# EAGLE design LM-317_power_supply (EAGLE 7.7.0)
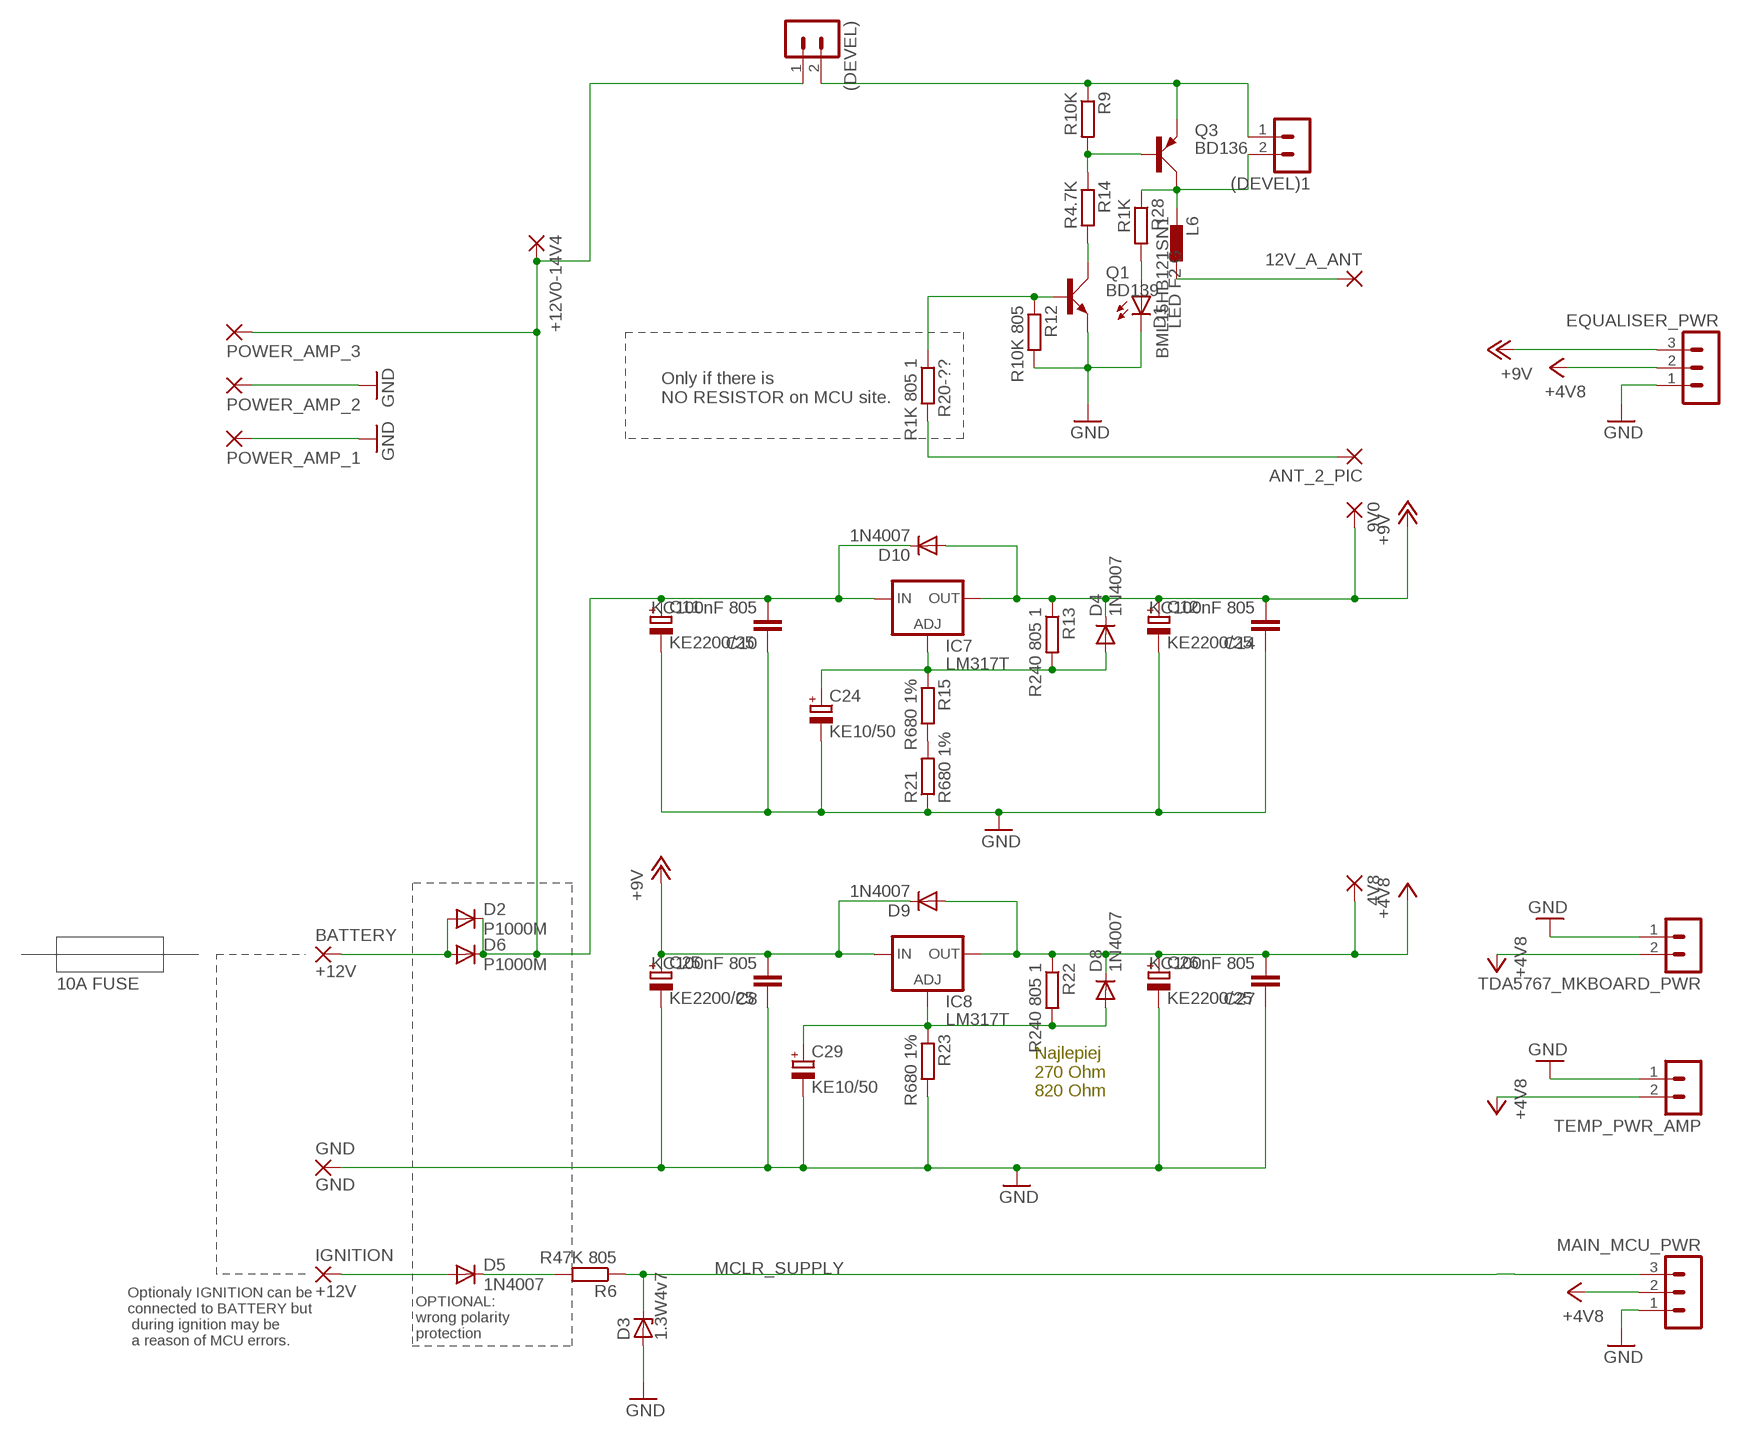
[diagram p0: schematic, sheet 1]

## Parts
4V8  3,17/1,3  [3,17/1,3]
9V0  3,17/1,3  [3,17/1,3]
12V_A_ANT  3,17/1,3  [3,17/1,3]
(DEVEL)  MA02-1  [MA02-1]
(DEVEL)1  MA02-1  [MA02-1]
+12V0-14V4  3,17/1,3  [3,17/1,3]
ANT_2_PIC  1,6/0,8  [1,6/0,8]
BATTERY  +12V  3,81/1,3  [3,81/1,3]
C8  KC100nF 805  C-EUC0805  [C0805]
C10  KC100nF 805  C-EUC0805  [C0805]
C11  KE2200/25  CPOL-EUE3.5-8  [E3,5-8]
C12  KE2200/25  CPOL-EUE3.5-8  [E3,5-8]
C14  KC100nF 805  C-EUC0805  [C0805]
C24  KE10/50  CPOL-EUTT2D4  [TT2D4]
C25  KE2200/25  CPOL-EUE3.5-8  [E3,5-8]
C26  KE2200/25  CPOL-EUE3.5-8  [E3,5-8]
C27  KC100nF 805  C-EUC0805  [C0805]
C29  KE10/50  CPOL-EUTT2D4  [TT2D4]
D1  LED F2 G  SFH482  [SFH482]
D2  P1000M  1N4004  [DO41-10]
D3  1.3W4v7  ZENER-DIODEZD-2.5  [ZDIO-2.5]
D4  1N4007  DIODE-D-5  [D-5]
D5  1N4007  DIODE-D-5  [D-5]
D6  P1000M  1N4004  [DO41-10]
D8  1N4007  DIODE-D-5  [D-5]
D9  1N4007  1N4004  [DO41-10]
D10  1N4007  1N4004  [DO41-10]
EQUALISER_PWR  MA03-1  [MA03-1]
GND  GND  3,81/1,3  [3,81/1,3]
IC7  LM317T  LM317TS  [317TS]
IC8  LM317T  LM317TS  [317TS]
IGNITION  +12V  3,81/1,3  [3,81/1,3]
L6  BML15HB121SN1  [0402]
MAIN_MCU_PWR  MA03-1  [MA03-1]
POWER_AMP_1  3,17/1,3  [3,17/1,3]
POWER_AMP_2  3,17/1,3  [3,17/1,3]
POWER_AMP_3  3,17/1,3  [3,17/1,3]
Q1  BD139  [TO126AV]
Q3  BD136  BD140  [TO126AV]
R6  R47K 805  R-EU_0204/2V  [0204V]
R9  R10K  R-EU_0204/5  [0204/5]
R12  R10K 805  R-EU_R0805  [R0805]
R13  R240 805 1  R-EU_M0805  [M0805]
R14  R4.7K  R-EU_0204/5  [0204/5]
R15  R680 1%  R-EU_0204/5  [0204/5]
R20-??  R1K 805 1  R-EU_0204/2V  [0204V]
R21  R680 1%  R-EU_0204/5  [0204/5]
R22  R240 805 1  R-EU_M0805  [M0805]
R23  R680 1%  R-EU_0204/5  [0204/5]
R28  R1K  R-EU_0204/7  [0204/7]
TDA5767_MKBOARD_PWR  MA02-1  [MA02-1]
TEMP_PWR_AMP  MA02-1  [MA02-1]

## Nets
+5V: 4V8.1(P) C26.+ C27.2 D8.C D9.A EQUALISER_PWR.2 IC8.2(OUT) MAIN_MCU_PWR.2 R22.1 TDA5767_MKBOARD_PWR.2 TEMP_PWR_AMP.2 ; supply symbol labelled +4V8
+12V: 9V0.1(P) C8.2 C12.+ C14.2 C25.+ D4.C D9.C D10.A EQUALISER_PWR.3 IC7.2(OUT) IC8.3(IN) R13.1 ; supply symbol labelled +9V
GND: C8.1 C10.1 C11.- C12.- C14.1 C24.- C25.- C26.- C27.1 C29.- D1.K(C) D3.A EQUALISER_PWR.1 GND.1(P) MAIN_MCU_PWR.1 POWER_AMP_1.1(P) POWER_AMP_2.1(P) Q1.E R12.2 R21.1 R23.2 TDA5767_MKBOARD_PWR.1 TEMP_PWR_AMP.1
MCLR_SUPPLY: D3.C MAIN_MCU_PWR.3 R6.1
N$1: ANT_2_PIC.1(P) R20-??.2
N$2: C24.+ D4.A IC7.1(ADJ) R13.2 R15.1
N$3: R15.2 R21.2
N$4: (DEVEL)1.1 (DEVEL).2 Q3.E R9.1
N$5: (DEVEL).1 +12V0-14V4.1(P) C10.2 C11.+ D2.C D6.C D10.C IC7.3(IN) POWER_AMP_3.1(P)
N$6: BATTERY.1(P) D2.A D6.A
N$13: D5.A IGNITION.1(P)
N$14: D5.C R6.2
N$18: Q1.B R12.1 R20-??.1
N$19: Q1.C R14.2
N$25: Q3.B R9.2 R14.1
N$26: (DEVEL)1.2 L6.1 Q3.C R28.1
N$27: C29.+ D8.A IC8.1(ADJ) R22.2 R23.1
N$33: 12V_A_ANT.1(P) L6.2
N$40: D1.A R28.2

## Notes on the sheet
- Only if there is
  NO RESISTOR on MCU site.
- 10A FUSE
- Najlepiej
  270 Ohm
  820 Ohm
- OPTIONAL:
  wrong polarity
  protection
- Optionaly IGNITION can be
  connected to BATTERY but
   during ignition may be
   a reason of MCU errors.

## Library data of the parts
4V8 9V0 12V_A_ANT +12V0-14V4 POWER_AMP_1-POWER_AMP_3 = wirepad:3,17/1,3: THROUGH-HOLE PAD
(DEVEL) (DEVEL)1 TDA5767_MKBOARD_PWR TEMP_PWR_AMP = con-lstb_SileliS:MA02-1: PIN HEADER
ANT_2_PIC = wirepad:1,6/0,8: THROUGH-HOLE PAD
BATTERY GND IGNITION = wirepad:3,81/1,3: THROUGH-HOLE PAD
C8 C10 C14 C27 = rcl:C-EU: CAPACITOR, European symbol
C11 C12 C24-C26 C29 = rcl:CPOL-EU: POLARIZED CAPACITOR, European symbol
D1 = led:SFH482: IR LED infrared emitting diode, Infineon
D2 D6 D9 D10 = diode:1N4004: DIODE general purpose rectifier, 1 A
D3 = diode:ZENER-DIODE: Z-Diode
D4 D5 D8 = diode:DIODE-: DIODE
EQUALISER_PWR MAIN_MCU_PWR = con-lstb_SileliS:MA03-1: PIN HEADER; OC_FARNELL: unknown; OC_NEWARK: unknown
IC7 IC8 = v-reg:LM317TS: VOLTAGE REGULATOR
L6 = inductors:BML15H: EMIFIL (R) Chip Ferrite Bead for GHz Noise Source: http://www.murata.com/ Ferrite Bead BLM15H.pdf
Q1 = transistor-power:BD139: NPN TRANSISTOR
Q3 = transistor-power:BD140: PNP TRANSISTOR
R6 R9 R12-R15 R20-?? R21-R23 R28 = rcl:R-EU_: RESISTOR, European symbol

## Board
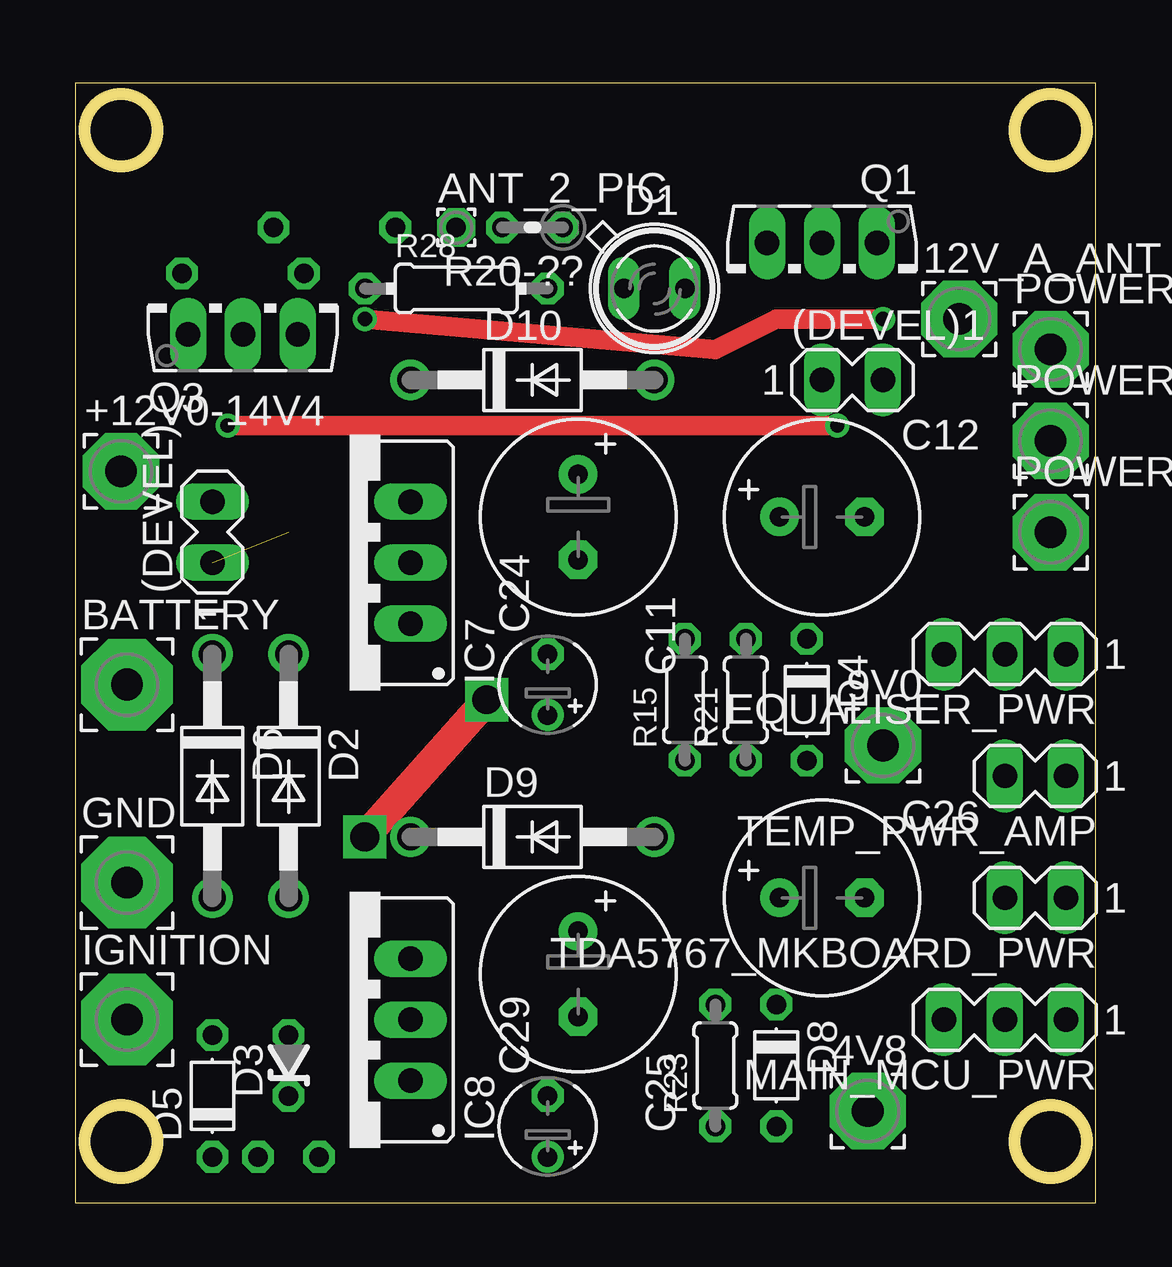
[diagram p1: board, top side]
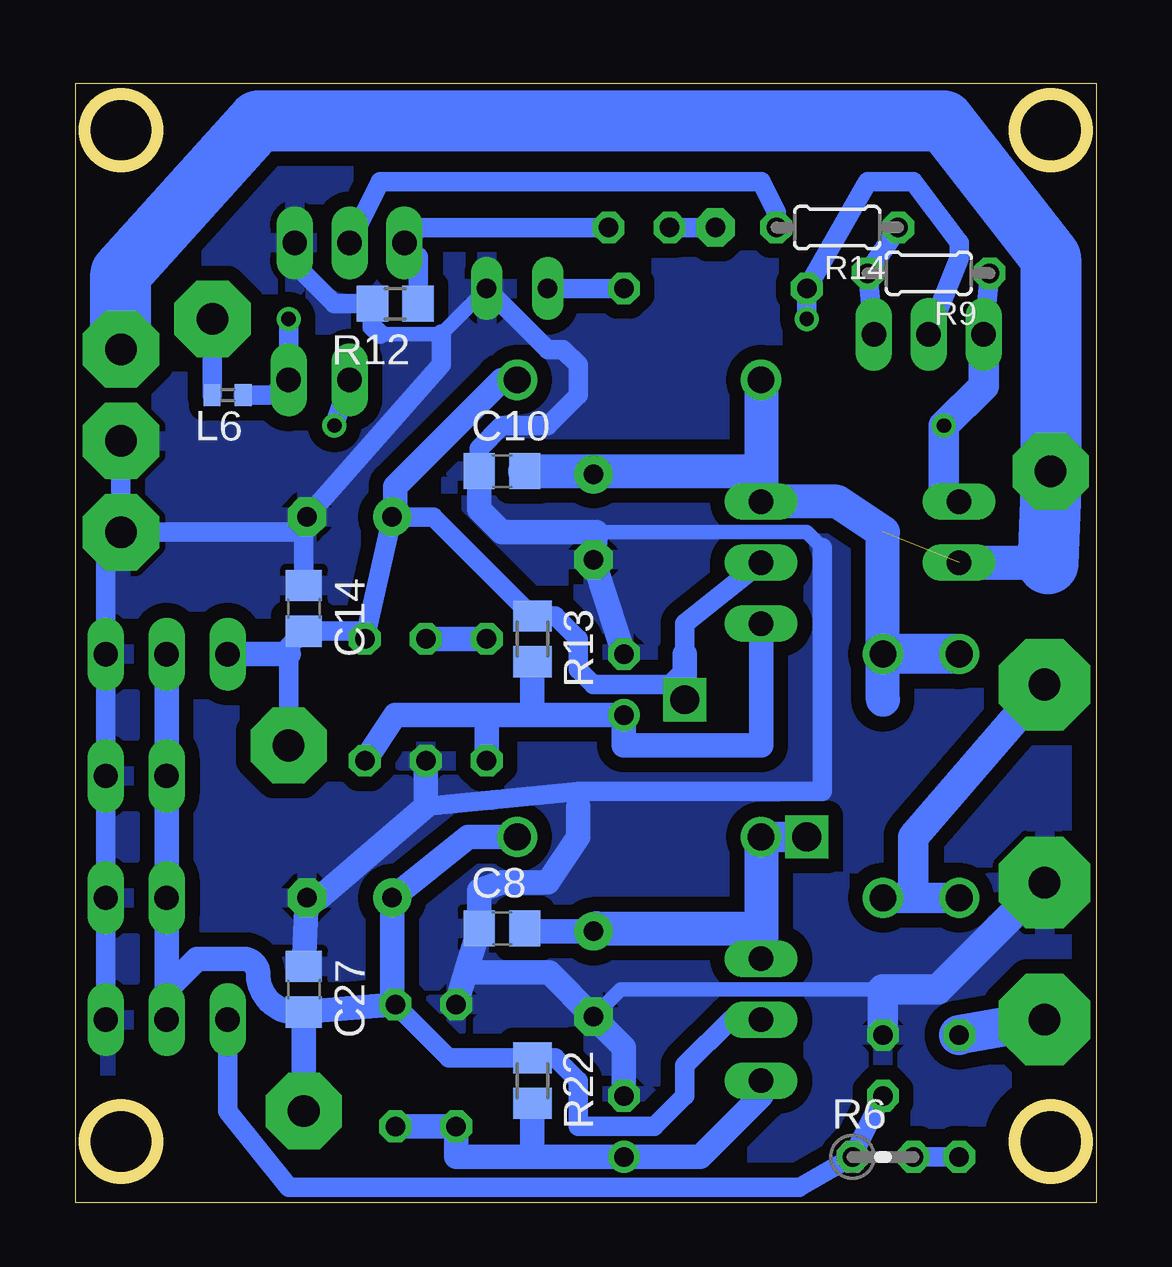
[diagram p2: board, bottom side, seen from below]

Size 42.52 x 46.66 mm. Coordinates in mm from the lower left corner, seen from the top.
Outline: 0,0 42.52,0 42.52,46.66 0,46.66 0,0
Outline: circle at 1.9,44.7 radius 1.5
Outline: circle at 40.64,2.54 radius 1.5
Outline: circle at 40.64,44.7 radius 1.5
Outline: circle at 1.9,2.54 radius 1.5
Copper layers (1*16): Top 0.035mm / dielectric 1.5mm / Bottom 0.035mm
Design rules "default": minimum track width 10mil, minimum drill 24mil, track to track 8mil, track to pad 8mil, pad to pad 8mil, via to via 8mil, smd to smd 8mil, copper to edge 40mil, drill to drill 8mil, minimum pad ring 10mil, minimum via ring 8mil, stop-mask expansion 4mil, vias tented up to drill 0mil, thermal gap 10mil

### Footprints (pad centres in the part's own frame; a part is rotated, then mirrored left to right if it is on the bottom)
3,17/1,3 = drill 1.321 pad 3.175 octagon: 1 0,0
MA02-1 = drill 1.016 long: 1 -2.54,0; 2 0,0
1,6/0,8 = drill 0.813 pad 1.6 octagon: 1 0,0
3,81/1,3 = drill 1.321 pad 3.81 octagon: 1 0,0
C0805 = smd 1.3 x 1.5: 1 -0.95,0; 2 0.95,0
E3,5-8 = drill 0.813 pad 1.6: + -1.778,0 | drill 0.813 pad 1.6 octagon: - 1.778,0
TT2D4 = drill 0.813: + -1.27,0 | drill 0.813 octagon: - 1.27,0
SFH482 = drill 0.813 long: A -1.27,0; K 1.27,0
DO41-10 = drill 1.118: A 5.08,0; C -5.08,0
ZDIO-2.5 = drill 0.813 octagon: A 1.27,0; C -1.27,0
D-5 = drill 0.813 octagon: A 2.54,0; C -2.54,0
MA03-1 = drill 1.016 long: 1 -2.54,0; 2 0,0; 3 2.54,0
317TS = drill 1.016 long: 1 -2.54,-2.54; 2 0,-2.54; 3 2.54,-2.54
0402 = smd 0.7 x 0.9: 1 -0.65,0; 2 0.65,0
TO126AV = drill 1.016 long: B 2.286,-1.27; C 0,-1.27; E -2.286,-1.27
0204V = drill 0.813 octagon: 1 -1.27,0; 2 1.27,0
0204/5 = drill 0.813 octagon: 1 -2.54,0; 2 2.54,0
R0805 = smd 1.3 x 1.5: 1 -0.95,0; 2 0.95,0
M0805 = smd 1.3 x 1.6: 1 -0.95,0; 2 0.95,0
0204/7 = drill 0.813 octagon: 1 -3.81,0; 2 3.81,0

### Placement (x,y rotation side)
4V8  33.02,3.81 0 top
9V0  33.66,19.05 0 top
12V_A_ANT  36.83,36.83 0 top
(DEVEL)  5.71,29.21 90 top
(DEVEL)1  33.66,34.29 0 top
+12V0-14V4  1.9,30.48 0 top
ANT_2_PIC  15.88,40.64 0 top
BATTERY  2.16,21.59 0 top
C8  24.77,11.43 0 bottom
C10  24.77,30.48 0 bottom
C11  20.95,28.57 270 top
C12  31.11,28.57 0 top
C14  33.02,24.77 270 bottom
C24  19.68,21.59 90 top
C25  20.95,9.53 270 top
C26  31.11,12.7 0 top
C27  33.02,8.89 270 bottom
C29  19.68,3.18 90 top
D1  24.13,38.1 0 top
D2  8.89,17.78 270 top
D3  8.89,5.71 90 top
D4  30.48,20.95 270 top
D5  5.71,4.45 90 top
D6  5.71,17.78 270 top
D8  29.21,5.71 270 top
D9  19.05,15.24 0 top
D10  19.05,34.29 0 top
EQUALISER_PWR  38.73,22.86 180 top
GND  2.16,13.33 0 top
IC7  11.43,26.67 90 top
IC8  11.43,7.62 90 top
IGNITION  2.16,7.62 0 top
L6  36.2,33.66 180 bottom
MAIN_MCU_PWR  38.73,7.62 180 top
POWER_AMP_1  40.64,27.94 0 top
POWER_AMP_2  40.64,31.75 0 top
POWER_AMP_3  40.64,35.56 0 top
Q1  31.11,38.73 180 top
Q3  6.98,37.46 0 top
R6  8.89,1.91 0 bottom
R9  6.98,38.73 180 bottom
R12  29.21,37.46 180 bottom
R13  23.49,23.49 270 bottom
R14  10.79,40.64 180 bottom
R15  25.4,20.95 90 top
R20-??  19.05,40.64 180 top
R21  27.94,20.95 90 top
R22  23.49,5.08 270 bottom
R23  26.67,5.71 90 top
R28  15.88,38.1 0 top
TDA5767_MKBOARD_PWR  38.73,12.7 180 top
TEMP_PWR_AMP  38.73,17.78 180 top

### Tracks (layer width: path | path; a pad name or v marks a point on that pad's centre or on a via)
+5V
  Bottom 0.813: IC8.2 15.24,7.62 17.14,5.71 17.14,4.45 18.41,3.18 21.59,3.18 21.59,5.08 22.54,6.03 R22.1 26.98,6.03 D8.C
  Bottom 1.016: C27.2 D8.C 29.34,8.38 C26.+ 26.16,15.24 D9.A | C27.2 4V8.1 | EQUALISER_PWR.2 TEMP_PWR_AMP.2 TDA5767_MKBOARD_PWR.2 MAIN_MCU_PWR.2 38.73,8.89 37.47,10.16 35.56,10.16 arc90 34.92,9.53 arc-100 C27.2
+12V  (via drill 1.2)
  Top 1.27: v12.06,15.24 v17.14,20.95
  Bottom 0.813: IC7.2 17.14,24.13 17.14,22.86 17.14,22.23 17.78,21.59 20.95,21.59 21.59,22.23 21.59,23.49 22.54,24.45 R13.1 27.62,28.57 C12.+ D4.C 30.8,23.81 C14.2 33.66,23.18 33.66,22.86 9V0.1
  Bottom 1.016: D10.A 24.77,34.29 29.21,29.84 29.21,28.7 C12.+ | EQUALISER_PWR.3 33.66,22.86 | C25.+ 23.81,11.3 C8.2 | v17.14,20.95 17.14,22.86
  Bottom 1.27: D9.C v12.06,15.24
  Bottom 1.422: D9.C 13.97,11.43 | 13.97,11.43 IC8.3 | C25.+ 20.83,11.43 13.97,11.43
GND
  Bottom 0.61: C25.- 19.81,8.89 8.89,8.89 | 11.43,27.3 12.06,27.94 21.08,27.94 | D1.K 27.3,36.2 29.84,36.2
  Bottom 0.813: C12.- 33.02,28.45 C14.1 | 21.08,27.94 C11.- | 11.43,27.3 11.43,17.15 21.59,17.15 | 21.59,17.15 21.59,16.51 | 27.94,16.51 21.59,17.15 | Q1.E 33.4,39.12 31.75,37.46 R12.2 30.16,36.51 29.84,36.2 | C12.- 33.53,27.94 POWER_AMP_1.1 | MAIN_MCU_PWR.1 TDA5767_MKBOARD_PWR.1 TEMP_PWR_AMP.1 EQUALISER_PWR.1 41.27,27.94 POWER_AMP_1.1 | POWER_AMP_1.1 POWER_AMP_2.1 | C12.- 27.3,34.92 27.3,36.2 | C10.1 25.71,31.43 24.77,32.38 22.86,32.38 21.59,33.66 21.59,34.92 22.22,35.56 22.86,35.56 D1.K
  Bottom 1.016: R23.2 26.27,9.6 | 26.27,9.6 C8.1 25.71,13.02 24.77,13.33 22.86,13.33 21.59,15.24 21.59,16.51 | C27.1 C26.- 32.38,12.7 27.94,16.51 R21.1 | 26.27,9.6 22.8,9.6 C25.- 19.68,6.48 C29.- | C24.- C11.- 20.83,27.94 21.08,27.94 24.77,27.94 25.71,28.89 C10.1
  Bottom 1.27: D3.A 8.89,8.89 6.6,8.89 GND.1
  Bottom 1.676: GND.1 2.54,13.97
  pour Bottom (isolate 0.61): -0.64,48.26 45.09,48.26 45.09,10.16 45.09,-2.54 -1.91,-2.54 -1.91,0 -1.91,46.99
MCLR_SUPPLY
  Bottom 0.813: MAIN_MCU_PWR.3 36.2,3.81 33.66,0.64 12.38,0.64 R6.1 D3.C
N$1
  Bottom 0.813: ANT_2_PIC.1 R20-??.2
N$2
  Bottom 1.016: 23.49,20.32 C24.+ 19.68,19.05 13.97,19.05 IC7.1 | R13.2 23.49,20.32 | D4.A 29.21,20.32 25.4,20.32 | 25.4,20.32 23.49,20.32 | R15.1 25.4,20.32
N$3
  Bottom 1.016: R15.2 R21.2
N$4  (via drill 0.6)
  Top 0.813: v6.35,32.38 v31.75,32.38
  Bottom 0.813: R9.1 Q3.E | v31.75,32.38 (DEVEL)1.1
  Bottom 1.27: (DEVEL).2 6.35,29.21 v6.35,32.38 4.7,34.04 Q3.E
N$5  (1 unrouted)
  Bottom 1.422: D10.C 13.97,30.48 | 13.97,30.48 IC7.3 10.79,29.21 8.89,27.94 D2.C 8.89,20.95 | 13.97,30.48 20.83,30.48 arc-90 C11.+ arc-90 21.08,30.48 C10.2 | 2.54,31.12 arc90 +12V0-14V4.1 | 2.54,29.84 arc90 1.9,29.21 | (DEVEL).1 2.01,26.67 2.01,26.62
  Bottom 1.676: D6.C D2.C
  Bottom 2.54: 2.01,26.62 1.9,29.21 +12V0-14V4.1 1.9,39.37 6.35,45.09 34.92,45.09 40.64,38.73 POWER_AMP_3.1
N$6
  Bottom 1.27: D6.A 7.62,12.7 | 7.62,12.7 D2.A | BATTERY.1 7.62,15.24 7.62,12.7
N$13
  Bottom 1.676: IGNITION.1 D5.A
N$14
  Bottom 0.813: D5.C R6.2
N$18
  Bottom 0.813: R20-??.1 28.19,40.64 Q1.B 28.26,39.44 R12.1
N$19
  Bottom 0.813: R14.2 13.33,41.27 13.97,42.55 29.84,42.55 Q1.C
N$25
  Bottom 0.813: Q3.B R9.2 R14.1
N$26  (via drill 0.6)
  Top 0.813: v12.06,36.83 26.67,35.56 29.21,36.83 v33.66,36.83
  Bottom 0.813: Q3.C 5.71,39.37 5.71,40 7.62,42.55 9.52,42.55 R28.1 v12.06,36.83 | L6.1 34.29,33.66 (DEVEL)1.2 v33.66,36.83
N$27
  Bottom 1.016: D8.A R23.1 26.67,1.91 23.49,1.91 | IC8.1 13.97,4.45 16.51,1.91 C29.+ 23.49,1.91 | R22.2 23.49,1.91
N$33
  Bottom 0.813: L6.2 36.83,33.67 12V_A_ANT.1
N$40
  Bottom 0.813: D1.A R28.2